# Altium schematic sheet [12]-POWER_CONNECTORS.SchDoc
size A4
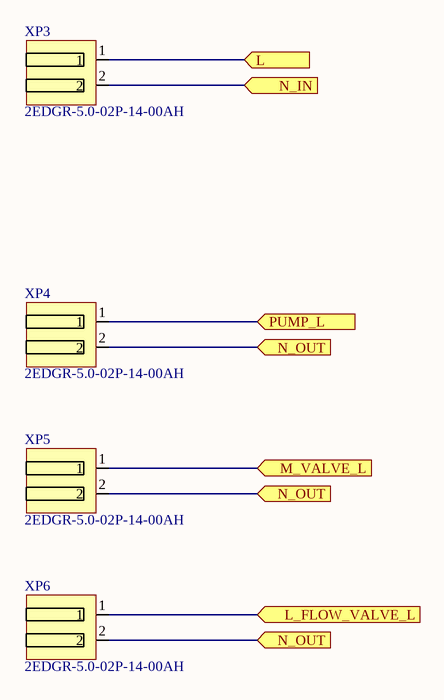
[diagram p0: [12]-POWER_CONNECTORS.SchDoc]

## Parts
XP3  2EDGR-5.0-02P-14-00AH  [2EDGR-5.0]
XP4  2EDGR-5.0-02P-14-00AH  [2EDGR-5.0]
XP5  2EDGR-5.0-02P-14-00AH  [2EDGR-5.0]
XP6  2EDGR-5.0-02P-14-00AH  [2EDGR-5.0]

## Ports
L (in), L_FLOW_VALVE_L (in), M_VALVE_L (in), N_IN (in), N_OUT (in), PUMP_L (in)

## Nets
L: XP3.1 ; port L
L_FLOW_VALVE_L: XP6.1 ; port L_FLOW_VALVE_L
M_VALVE_L: XP5.1 ; port M_VALVE_L
N_IN: XP3.2 ; port N_IN
N_OUT: XP4.2 XP5.2 XP6.2 ; port N_OUT
PUMP_L: XP4.1 ; port PUMP_L

## Library data of the parts
XP3-XP6 = 2EDGR-5.0-02P-14-00AH: Value: 2EDGR-5.0-02P-14-00AH